# EAGLE schematic starduino (EAGLE 7.6.0)
DOC_NUM: 1; REVISION: 2.0
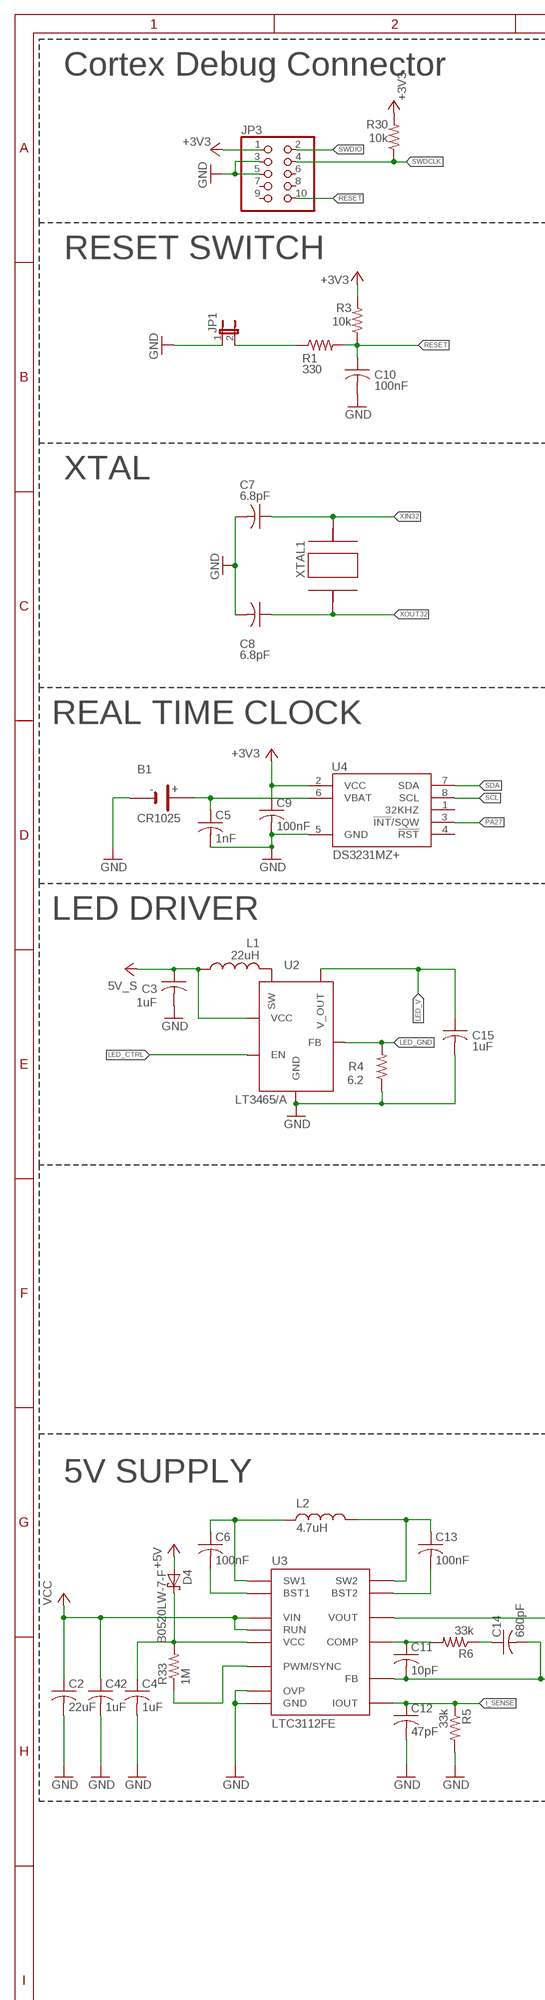
[diagram p0: schematic, sheet 1, part 1 of 2]
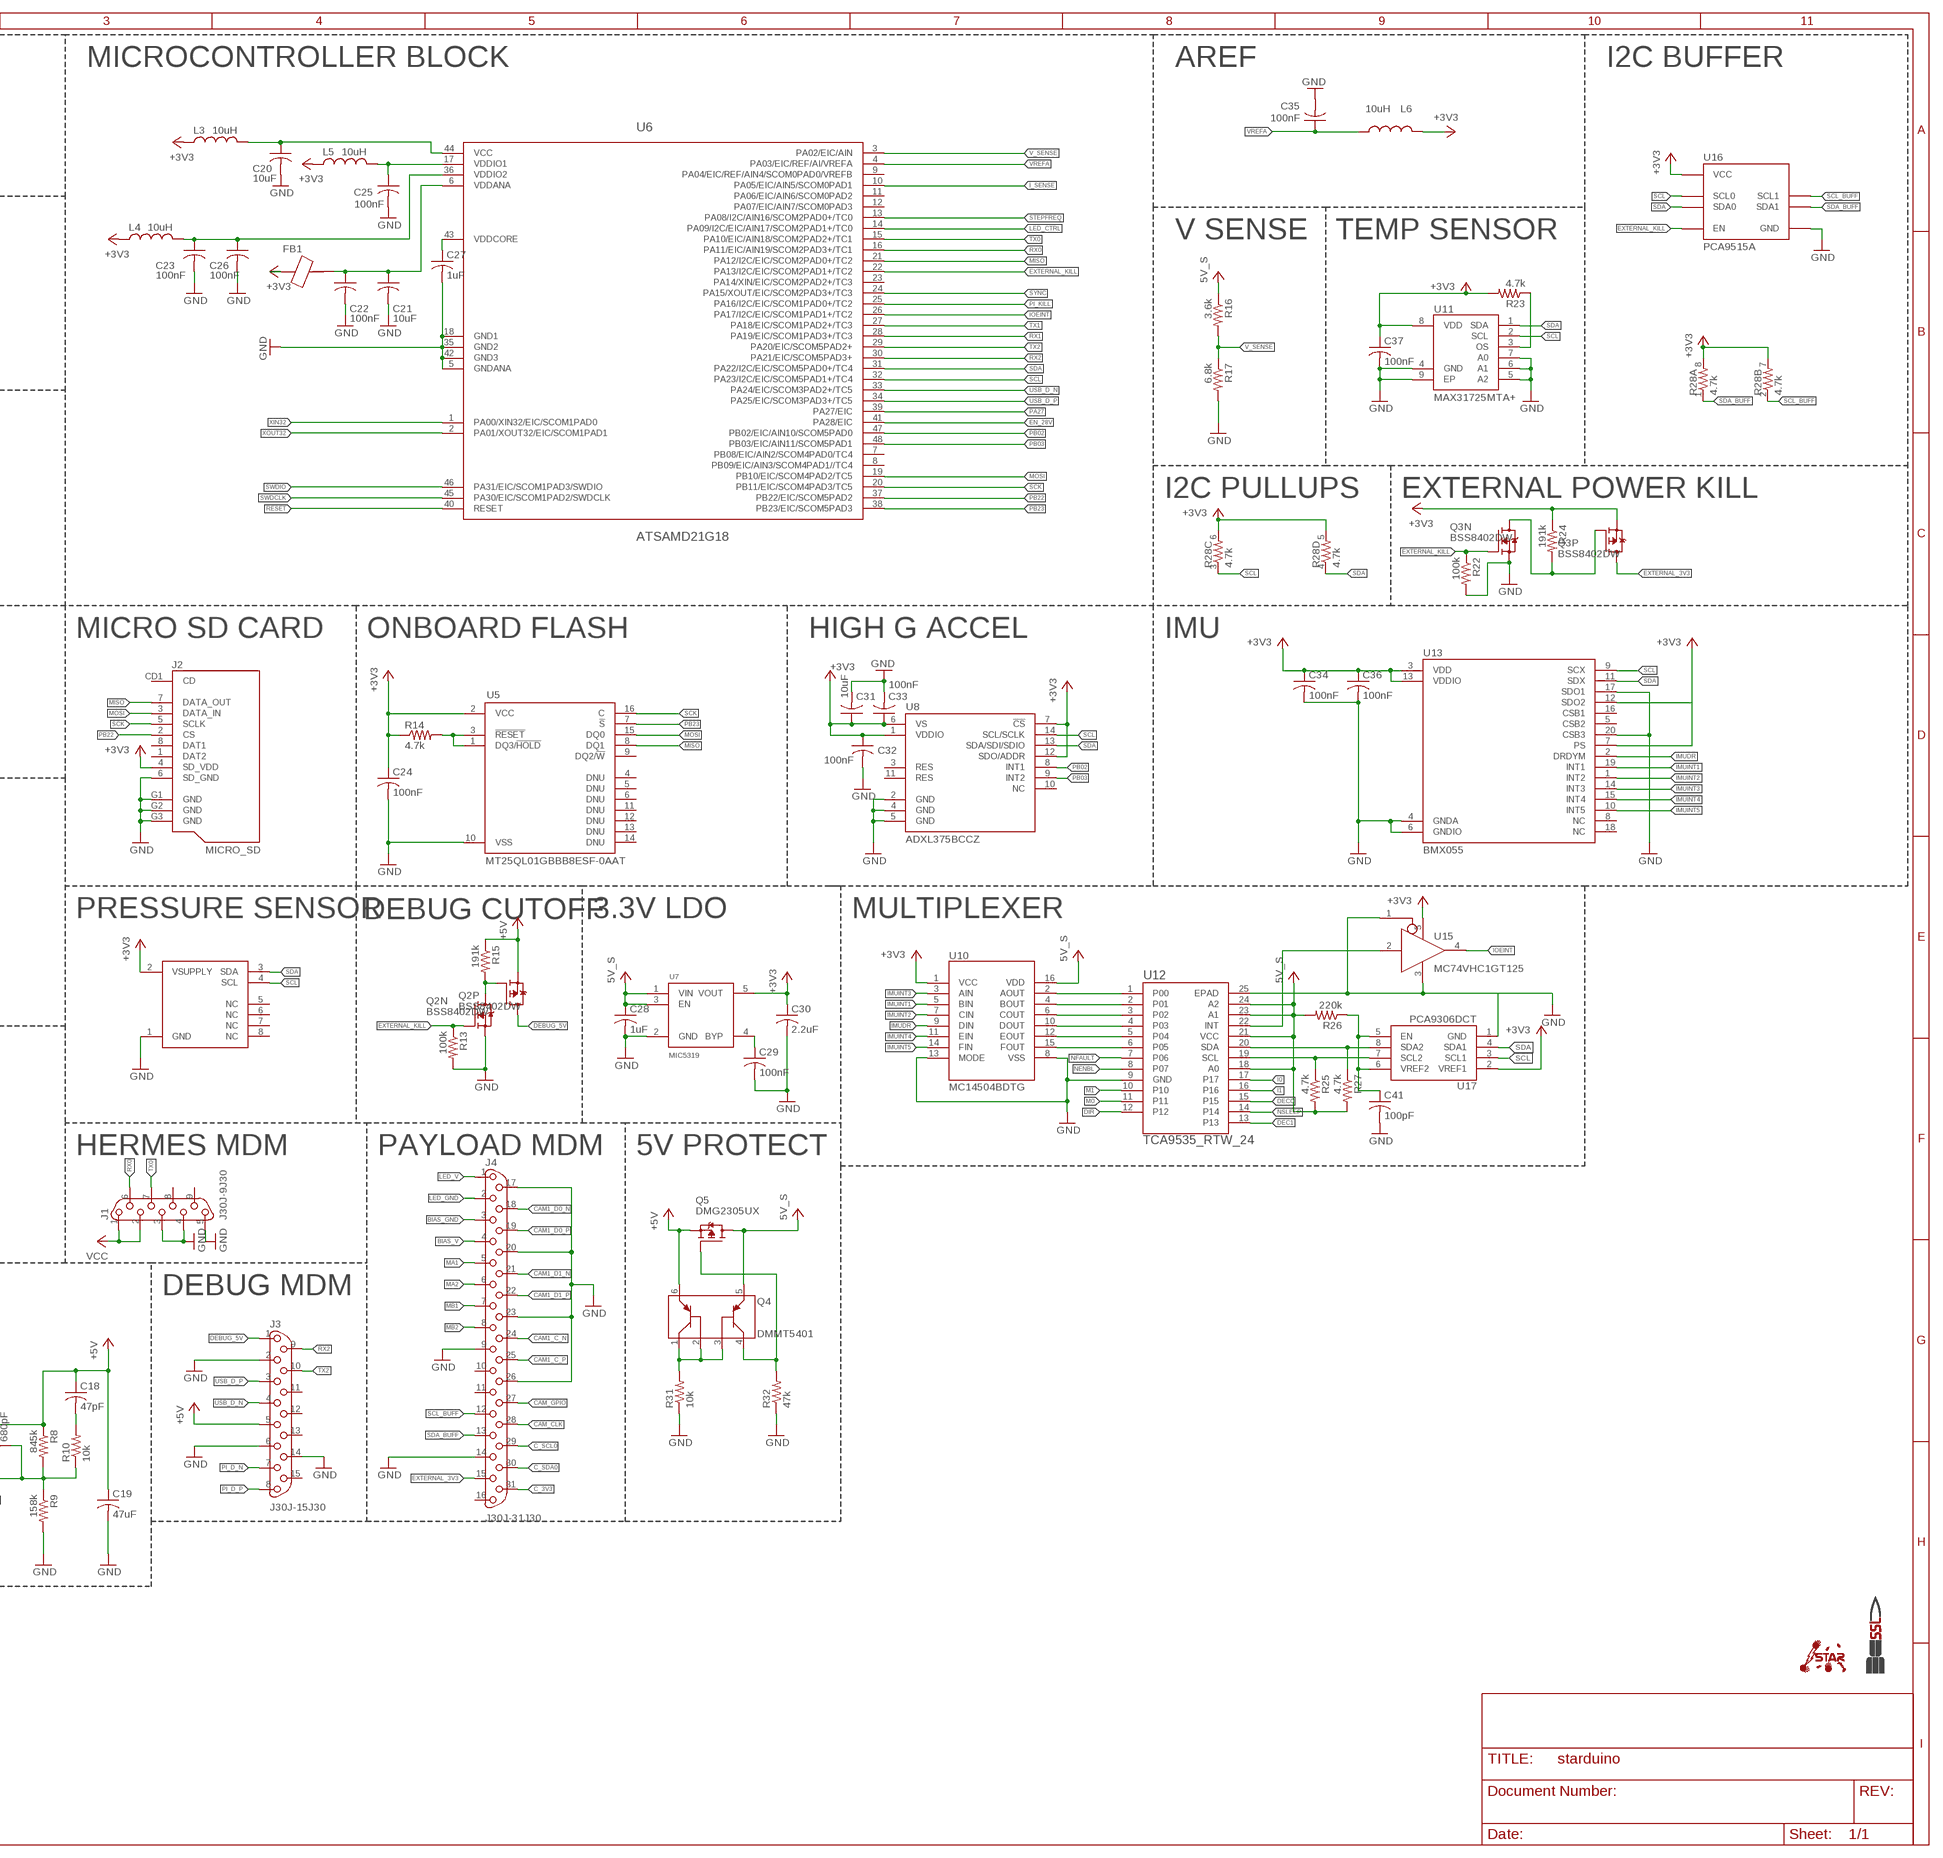
[diagram p1: schematic, sheet 1, part 2 of 2]

## Parts
B1  CR1025  [CR1025]
C2  22uF  C-USC1206  [C1206]
C3  1uF  C-USC0603  [C0603]
C4  1uF  C-USC0603  [C0603]
C5  1nF  C-USC0603  [C0603]
C6  100nF  C-USC0603  [C0603]
C7  6.8pF  C-USC0603  [C0603]
C8  6.8pF  C-USC0603  [C0603]
C9  100nF  C-USC0603  [C0603]
C10  100nF  C-USC0603  [C0603]
C11  10pF  C-USC0603  [C0603]
C12  47pF  C-USC0603  [C0603]
C13  100nF  C-USC0603  [C0603]
C14  680pF  C-USC0603  [C0603]
C15  1uF  C-USC0603  [C0603]
C18  47pF  C-USC0603  [C0603]
C19  47uF  C-USC1210  [C1210]
C20  10uF  C-USC0603  [C0603]
C21  10uF  C-USC0603  [C0603]
C22  100nF  C-USC0603  [C0603]
C23  100nF  C-USC0603  [C0603]
C24  100nF  C-USC0603  [C0603]
C25  100nF  C-USC0603  [C0603]
C26  100nF  C-USC0603  [C0603]
C27  1uF  C-USC0603  [C0603]
C28  1uF  C-USC0603  [C0603]
C29  100nF  C-USC0603  [C0603]
C30  2.2uF  C-USC0603  [C0603]
C31  10uF  C-USC0603  [C0603]
C32  100nF  C-USC0603  [C0603]
C33  100nF  C-USC0603  [C0603]
C34  100nF  C-USC0603  [C0603]
C35  100nF  C-USC0603  [C0603]
C36  100nF  C-USC0603  [C0603]
C37  100nF  C-USC0603  [C0603]
C41  100pF  C-USC0603  [C0603]
C42  1uF  C-USC0603  [C0603]
D4  B0520LW-7-F  SCHOTTKY-DIODESOD123  [SOD123]
FB1  BLM18KG221BH1D  FERRITE_BEAD-0603  [0603]
J1  J30J-9J30  [ZKN-9-J30]
J2  MICRO_SD  [MICROSD_PUSH_PUSH_AMPHENOL]
J3  J30J-15J30  [ZKN-15-J30]
J4  J30J-31J30  [ZKN-31-J30]
JP1  JUMPER-2PTH  [1X02]
JP3  PINHD-2X5  [2X05]
L1  22uH  INDUCTOR-VLF504012MT  [VLF504012MT(TDK)]
L2  4.7uH  SRP5030T  [SRP5030]
L3  10uH  INDUCTOR-0603  [0603]
L4  10uH  INDUCTOR-0603  [0603]
L5  10uH  INDUCTOR-0603  [0603]
L6  10uH  INDUCTOR-0603  [0603]
Q2  BSS8402DW  [SC70]
Q3  BSS8402DW  [SC70]
Q4  DMMT5401  [SOT-26]
Q5  DMG2305UX  [SOT23]
R1  330  R-US_R0603  [R0603]
R3  10k  R-US_R0603  [R0603]
R4  6.2  R-US_R0603  [R0603]
R5  33k  R-US_R0603  [R0603]
R6  33k  R-US_R0603  [R0603]
R8  845k  R-US_R0603  [R0603]
R9  158k  R-US_R0603  [R0603]
R10  10k  R-US_R0603  [R0603]
R13  100k  R-US_R0603  [R0603]
R14  4.7k  R-US_R0603  [R0603]
R15  191k  R-US_R0603  [R0603]
R16  3.6k  R-US_R0603  [R0603]
R17  6.8k  R-US_R0603  [R0603]
R22  100k  R-US_R0603  [R0603]
R23  4.7k  R-US_R0603  [R0603]
R24  191k  R-US_R0603  [R0603]
R25  4.7k  R-US_R0603  [R0603]
R26  220k  R-US_R0603  [R0603]
R27  4.7k  R-US_R0603  [R0603]
R28  4.7k  RESISTOR-ARRAY0603-ARV  [0603-ARV]
R30  10k  R-US_R0603  [R0603]
R31  10k  R-US_R0603  [R0603]
R32  47k  R-US_R0603  [R0603]
R33  1M  R-US_R0603  [R0603]
U1  SSCMNNN015PA2A3  [HSC-SMT-8]
U2  LT3465/A  [SOT23-6]
U3  LTC3112FE  [TSSOP20]
U4  DS3231MZ+  [SOIC-8]
U5  MT25QL01GBBB8ESF-0AAT  [SOP2-16]
U6  ATSAMD21G18  [48-TQFP]
U7  MIC5319  [SOT23-5L]
U8  ADXL375BCCZ  [LGA-14]
U10  MC14504BDTG  [TSSOP16]
U11  MAX31725MTA+  [DFN-8]
U12  TCA9535_RTW_24  [RTW24_2P45X2P45]
U13  BMX055  [LGA-20]
U15  MC74VHC1GT125  [SC-70-5]
U16  PCA9515A  [TSSOP8]
U17  PCA9306DCT  [SSOP8]
U$1  STAR  [STAR_.3IN]
U$2  SSL.3IN_SILK  [SSL_SILK_.3IN]
XTAL1  ABS07AIG-32.768KHZ-1-T  ABS07AIG-32.768KHZ-1-T  [2-SMD]

## Nets
5V_S: C3.1 C28.1 L1.P$1 Q4.5(E2) Q5.3(D) R16.1 R25.2 R26.2 R27.2 U2.5(VCC) U7.1(VIN) U7.3(EN) U10.16(VDD) U12.18(A0) U12.21(VCC) U12.23(A1) U12.24(A2)
+3V3: C9.1 C24.1 C30.1 C31.1 C32.1 C33.1 C34.1 C36.1 C37.1 FB1.1 J2.4(SD_VDD) JP3.1 L3.1 L4.1 L5.1 L6.2 Q3.4(P:S) R3.2 R14.1 R23.2 R24.1 R28.5 R28.6 R28.7 R28.8 R30.2 U1.2(VSUPPLY) U4.2(VCC) U5.2(VCC) U7.5(VOUT) U8.1(VDDIO) U8.6(VS) U8.7(!CS!) U8.12(SDO/ADDR) U10.1(VCC) U11.8(VDD) U13.3(VDD) U13.7(PS) U13.12(SDO2) U13.13(VDDIO) U15.5(VIN) U16.P$8(VCC) U17.2(VREF1)
+5V: C18.1 C19.1 D4.A J3.5 Q2.4(P:S) Q4.6(E1) Q5.2(S) R8.1 R15.1 U3.9(VOUT)
BIAS_GND: J4.3
BIAS_V: J4.4
C_3V3: J4.31
C_SCL0: J4.29
C_SDA0: J4.30
CAM1_C_N [DIFF_PAIR]: J4.24
CAM1_C_P [DIFF_PAIR]: J4.25
CAM1_D0_N [DIFF_PAIR]: J4.18
CAM1_D0_P [DIFF_PAIR]: J4.19
CAM1_D1_N [DIFF_PAIR]: J4.21
CAM1_D1_P [DIFF_PAIR]: J4.22
CAM_CLK: J4.28
CAM_GPIO: J4.27
DEBUG_5V: J3.1 Q2.3(P:D)
DEC0: U12.15
DEC1: U12.13
DIR: U12.12
EN_28V: U6.41(PA28/EIC)
EXTERNAL_3V3: J4.15 Q3.3(P:D)
EXTERNAL_KILL: Q2.2(N:G) Q3.2(N:G) R13.1 R22.1 U6.22(PA13/I2C/EIC/SCOM2PAD1+/TC2) U16.P$5(EN)
FB_5 [PWR_SIG]: C11.2 C14.2 R8.2 R9.1 R10.1 U3.3(FB)
GND: B1.3(-) C2.2 C3.2 C4.2 C5.2 C7.2 C8.2 C9.2 C10.2 C12.2 C15.2 C19.2 C20.2 C21.2 C22.2 C23.2 C24.2 C25.2 C26.2 C27.2 C28.2 C29.2 C30.2 C31.2 C32.2 C33.2 C34.2 C35.2 C36.2 C37.2 C41.2 C42.2 J1.3 J1.4 J1.5 J2.6(SD_GND) J2.G1(GND) J2.G2(GND) J2.G3(GND) J3.2 J3.6 J3.14 J4.9 J4.14 J4.17 J4.20 J4.23 J4.26 JP1.1 JP3.3 JP3.5 Q2.1(N:S) Q3.1(N:S) R4.1 R5.2 R9.2 R13.2 R17.2 R22.2 R31.1 R32.1 U1.1(GND) U2.2(GND) U3.1(GND) U3.4(OVP) U3.10(GND) U3.11(GND) U3.20(GND) U3.PAD(GND) U4.5(GND) U5.10(VSS) U6.5(GNDANA) U6.18(GND1) U6.35(GND2) U6.42(GND3) U7.2(GND) U8.2(GND) U8.4(GND) U8.5(GND) U10.8(VSS) U10.13(MODE) U11.4(GND) U11.5(A2) U11.6(A1) U11.7(A0) U11.9(EP) U12.9(GND) U12.25(EPAD) U13.4(GNDA) U13.6(GNDIO) U13.17(SDO1) U13.20(CSB3) U15.1(OE) U15.3(GND) U16.P$4(GND) U17.1(GND)
I0: U12.17
I1: U12.16
I_SENSE [CTRL_SIG]: C12.1 R5.1 U3.8(IOUT) U6.10(PA05/EIC/AIN5/SCOM0PAD1)
IMUDR: U10.9(DIN) U13.2(DRDYM)
IMUINT1: U10.5(BIN) U13.19(INT1)
IMUINT2: U10.7(CIN) U13.1(INT2)
IMUINT3: U10.3(AIN) U13.14(INT3)
IMUINT4: U10.11(EIN) U13.15(INT4)
IMUINT5: U10.14(FIN) U13.10(INT5)
IOEINT: U6.26(PA17/I2C/EIC/SCOM1PAD1+/TC2) U15.4(Y)
LED_CTRL: U2.4(EN) U6.14(PA09/I2C/EIC/AIN17/SCOM2PAD1+/TC0)
LED_GND: J4.2 R4.2 U2.3(FB)
LED_V: C15.1 J4.1 U2.1(V_OUT)
M0: U12.11
M1: U12.10
MA1: J4.5
MA2: J4.6
MB1: J4.7
MB2: J4.8
MISO: J2.7(DATA_OUT) U5.8(DQ1) U6.21(PA12/I2C/EIC/SCOM2PAD0+/TC2)
MOSI: J2.3(DATA_IN) U5.15(DQ0) U6.19(PB10/EIC/SCOM4PAD2/TC5)
N$1: Q4.4(C2) Q5.1(G) R32.2
N$2: Q4.1(C1) Q4.2(B1) Q4.3(B2) R31.2
N$3 [PWR_SIG]: R33.1 U3.19(PWM/SYNC)
N$4: C25.1 L5.2 U6.17(VDDIO1)
N$5: C27.1 U6.43(VDDCORE)
N$6: R23.1 U11.3(OS)
N$7: JP1.2 R1.1
N$8: B1.1(+) B1.2(+) C5.1 U4.6(VBAT)
N$9: C29.1 U7.4(BYP)
N$10: C21.1 C22.1 FB1.2 U6.6(VDDANA)
N$11: C14.1 R6.1
N$12: C11.1 R6.2 U3.2(COMP)
N$13: C20.1 L3.2 U6.44(VCC)
N$15: L1.P$2 U2.6(SW)
N$18: Q3.5(P:G) Q3.6(N:D) R24.2
N$19: U10.2(AOUT) U12.1(P00)
N$23: U10.4(BOUT) U12.2(P01)
N$24: C23.1 C26.1 L4.2 U6.36(VDDIO2)
N$25: U12.22(INT) U15.2(A)
N$28: U10.6(COUT) U12.3(P02)
N$29: U10.10(DOUT) U12.4(P03)
N$30: U10.12(EOUT) U12.5(P04)
N$31: U10.15(FOUT) U12.6(P05)
N$32: R14.2 U5.1(DQ3/!HOLD!) U5.3(!RESET!)
N$33: R27.1 U12.20(SDA) U17.8(SDA2)
N$34: R25.1 U12.19(SCL) U17.7(SCL2)
N$35: C41.1 R26.1 U17.5(EN) U17.6(VREF2)
N$38: Q2.5(P:G) Q2.6(N:D) R15.2
N$39: C6.1 L2.P$1 U3.15(SW1) U3.16(SW1)
N$40: C13.1 L2.P$2 U3.12(SW2) U3.13(SW2)
N$41: C6.2 U3.17(BST1)
N$42: C13.2 U3.14(BST2)
N$43 [PWR_SIG]: C4.1 D4.C R33.2 U3.18(VCC)
N$48: C18.2 R10.2
NENBL: U12.8(P07)
NFAULT: U12.7(P06)
NSLEEP: U12.14
PA27: U4.3(!INT!/SQW) U6.39(PA27/EIC)
PB02: U6.47(PB02/EIC/AIN10/SCOM5PAD0) U8.8(INT1)
PB03: U6.48(PB03/EIC/AIN11/SCOM5PAD1) U8.9(INT2)
PB22: J2.2(CS) U6.37(PB22/EIC/SCOM5PAD2)
PB23: U5.7(!S!) U6.38(PB23/EIC/SCOM5PAD3)
PI_D_N: J3.7
PI_D_P: J3.8
PI_KILL: U6.25(PA16/I2C/EIC/SCOM1PAD0+/TC2)
RESET: C10.1 JP3.10 R1.2 R3.1 U6.40(RESET)
RX0: J1.6 U6.16(PA11/EIC/AIN19/SCOM2PAD3+/TC1)
RX1: U6.28(PA19/EIC/SCOM1PAD3+/TC3)
RX2: J3.9 U6.30(PA21/EIC/SCOM5PAD3+)
SCK: J2.5(SCLK) U5.16(C) U6.20(PB11/EIC/SCOM4PAD3/TC5)
SCL: R28.3 U1.4(SCL) U4.8(SCL) U6.32(PA23/I2C/EIC/SCOM5PAD1+/TC4) U8.14(SCL/SCLK) U11.2(SCL) U13.9(SCX) U16.P$2(SCL0) U17.3(SCL1)
SCL_BUFF: J4.12 R28.2 U16.P$7(SCL1)
SDA: R28.4 U1.3(SDA) U4.7(SDA) U6.31(PA22/I2C/EIC/SCOM5PAD0+/TC4) U8.13(SDA/SDI/SDIO) U11.1(SDA) U13.11(SDX) U16.P$3(SDA0) U17.4(SDA1)
SDA_BUFF: J4.13 R28.1 U16.P$6(SDA1)
STEPFREQ: U6.13(PA08/I2C/AIN16/SCOM2PAD0+/TC0)
SWDCLK: JP3.4 R30.1 U6.45(PA30/EIC/SCOM1PAD2/SWDCLK)
SWDIO: JP3.2 U6.46(PA31/EIC/SCOM1PAD3/SWDIO)
SYNC: U6.24(PA15/XOUT/EIC/SCOM2PAD3+/TC3)
TX0: J1.7 U6.15(PA10/EIC/AIN18/SCOM2PAD2+/TC1)
TX1: U6.27(PA18/EIC/SCOM1PAD2+/TC3)
TX2: J3.10 U6.29(PA20/EIC/SCOM5PAD2+)
USB_D_N: J3.4 U6.33(PA24/EIC/SCOM3PAD2+/TC5)
USB_D_P: J3.3 U6.34(PA25/EIC/SCOM3PAD3+/TC5)
V_SENSE: R16.2 R17.1 U6.3(PA02/EIC/AIN)
VCC: C2.1 C42.1 J1.1 J1.2 U3.5(VIN) U3.6(VIN) U3.7(RUN)
VREFA: C35.1 L6.1 U6.4(PA03/EIC/REF/AI/VREFA)
XIN32: C7.1 U6.1(PA00/XIN32/EIC/SCOM1PAD0) XTAL1.P2
XOUT32: C8.1 U6.2(PA01/XOUT32/EIC/SCOM1PAD1) XTAL1.P1
Unconnected: J1.8 J1.9 J2.1(DAT2) J2.8(DAT1) J2.CD1(CD) J3.11 J3.12 J3.13 J3.15 J4.10 J4.11 J4.16 JP3.6 JP3.7 JP3.8 JP3.9 U1.5(NC) U1.6(NC) U1.7(NC) U1.8(NC) U4.1(32KHZ) U4.4(!RST!) U5.4(DNU) U5.5(DNU) U5.6(DNU) U5.9(DQ2/!W!) U5.11(DNU) U5.12(DNU) U5.13(DNU) U5.14(DNU) U6.7(PB08/EIC/AIN2/SCOM4PAD0/TC4) U6.8(PB09/EIC/AIN3/SCOM4PAD1//TC4) U6.9(PA04/EIC/REF/AIN4/SCOM0PAD0/VREFB) U6.11(PA06/EIC/AIN6/SCOM0PAD2) U6.12(PA07/EIC/AIN7/SCOM0PAD3) U6.23(PA14/XIN/EIC/SCOM2PAD2+/TC3) U8.3(RES) U8.10(NC) U8.11(RES) U13.5(CSB2) U13.8(NC) U13.16(CSB1) U13.18(NC)

## Notes on the sheet
- Cortex Debug Connector | MICROCONTROLLER BLOCK | AREF | I2C BUFFER
- RESET SWITCH
- V SENSE | TEMP SENSOR
- XTAL
- I2C PULLUPS | EXTERNAL POWER KILL
- REAL TIME CLOCK | MICRO SD CARD | ONBOARD FLASH | HIGH G ACCEL | IMU
- LED DRIVER
- PRESSURE SENSOR | DEBUG CUTOFF | 3.3V LDO | MULTIPLEXER
- HERMES MDM | PAYLOAD MDM | 5V PROTECT
- DEBUG MDM
- 5V SUPPLY

## Library data of the parts
B1 = NR_connectors:CR1025
C2-C15 C18-C37 C42 = resistor:C-US: CAPACITOR, American symbol
C41 = rcl:C-US: CAPACITOR, American symbol
D4 = CM_diodes:SCHOTTKY-DIODE: Schottky Diode
FB1 = AR_passives:FERRITE_BEAD
J1 = CM_J30J:J30J-9
J2 = NR_connectors:MICRO_SD
J3 = CM_J30J:J30J-15
J4 = CM_J30J:J30J-31
JP1 = CM_passives:JUMPER-2: Jumper Basic 0.1" spaced jumper. Use with breakaway headers.
JP3 = pinhead:PINHD-2X5: PIN HEADER
L1 L3-L6 = AR_passives:INDUCTOR
L2 = CM_passives:SRP5030T
Q2 Q3 = transistor-fet:BSS8402DW
Q4 = transistor-pnp:DMMT5401
Q5 = transistor-fet:DMG2305UX
R1 R3-R6 R8-R10 R13-R17 R22-R24 R30-R33 = resistor:R-US_: RESISTOR, American symbol
R25-R27 = rcl:R-US_: RESISTOR, American symbol
R28 = SparkFun-Passives:RESISTOR-ARRAY: Array Chip Resistor Source: RS Component / Phycomp
U1 = NR_IC:SSCMNNN015PA2A3
U2 = AR_IC:LT3465/A: LT3465/A LED Driver (Linear Technologies)
U3 = CM_IC:LTC3112
U4 = NR_IC:DS3231MZ+
U5 = NR_IC:MT25QL01GBBB8ESF-0AAT
U6 = AR_mcu:ATSAMD21G18
U7 = CM_IC:MIC5319
U8 = NR_IC:ADXL375BCCZ
U10 = MotorDriver:MC14504BDTG
U11 = NR_IC:MAX31725MTA+
U12 = MotorDriver:TCA9535_RTW_24; MANUFACTURER_PART_NUMBER: tca9535_rtw_24; VENDOR: Texas Instruments
U13 = NR_IC:BMX055
U15 = CM_IC:MC74VHC1GT125
U16 = CM_IC:PCA9515A
U17 = MotorDriver:PCA9306
U$1 = images:STAR
U$2 = images:SSL
XTAL1 = AR_XTAL:ABS07AIG-32.768KHZ-1-T

## Net classes
0 default: width 0.152 mm, drill 0.381 mm, clearance 0.152 mm
1 PWR_SIG: width 0.203 mm, drill 0.381 mm, clearance 0.152 mm
2 CTRL_SIG: width 0.203 mm, drill 0.381 mm, clearance 0.152 mm
3 DIFF_PAIR: width 0.152 mm, drill 0.33 mm, clearance 0.152 mm